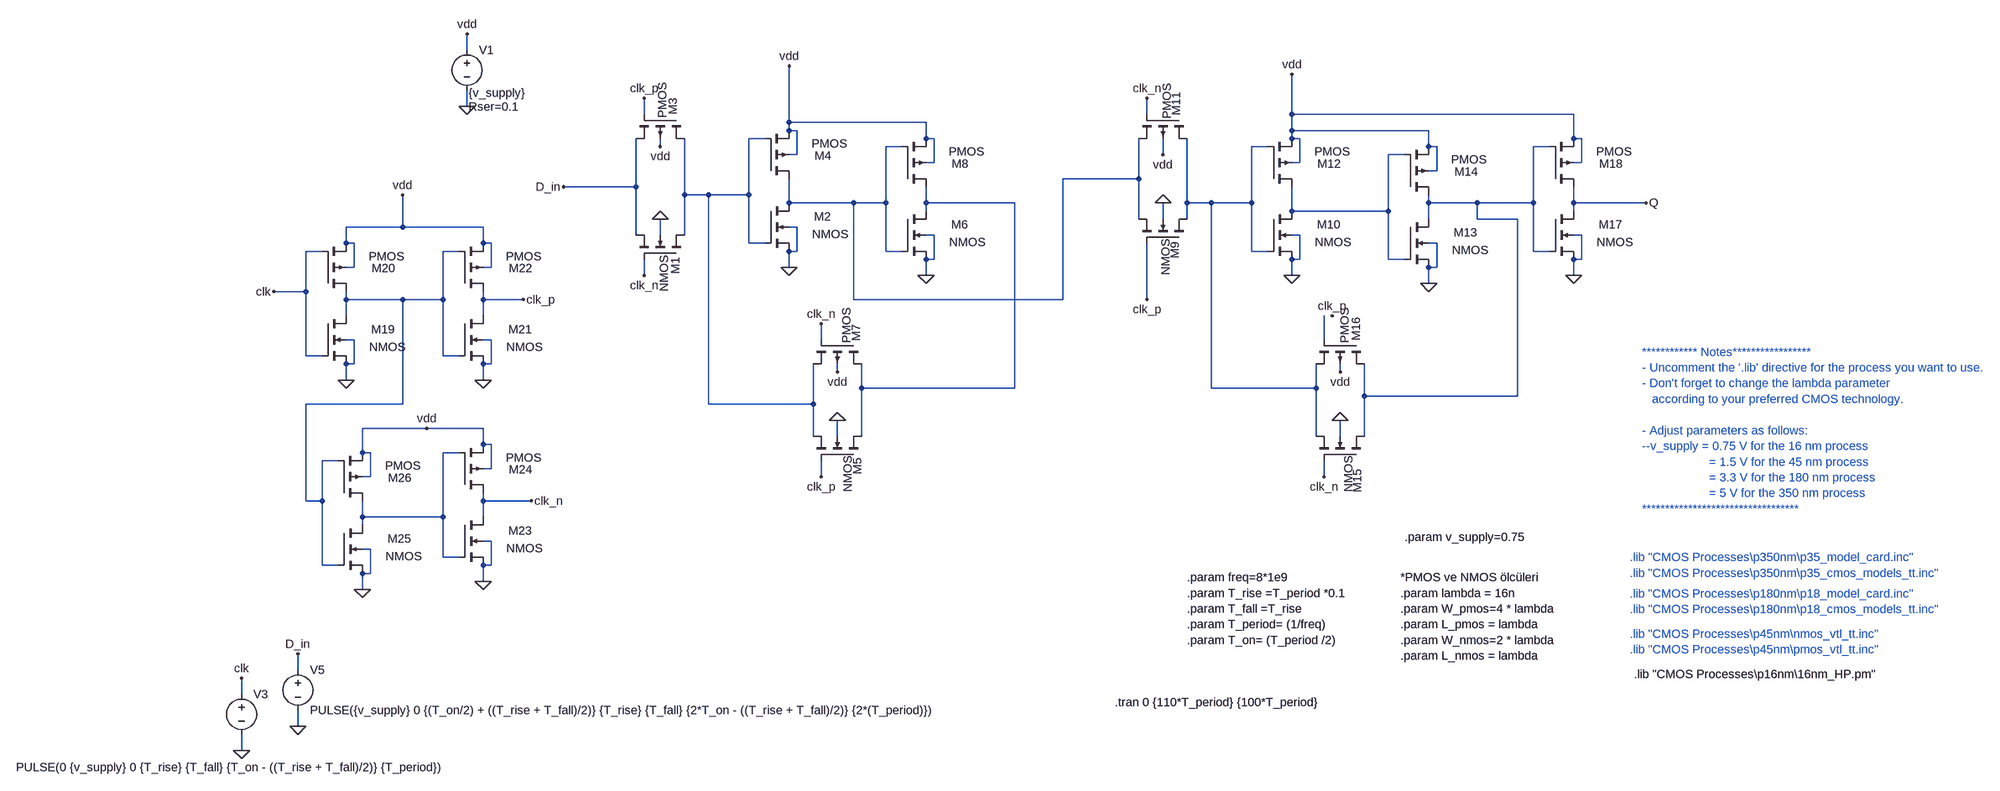
[diagram p0: schematic D_FF_sim.asc]
D_FF_sim.asc, the LTspice schematic file:
Version 4
SHEET 1 3284 1428
WIRE 96 -176 96 -208
WIRE 96 -64 96 -96
WIRE 448 -48 448 -80
WIRE 1552 -48 1552 -80
WIRE 1840 -48 1840 -128
WIRE 2400 -48 1840 -48
WIRE 736 -32 736 -144
WIRE 1008 -32 736 -32
WIRE 736 -16 736 -32
WIRE 752 -16 736 -16
WIRE 1840 -16 1840 -48
WIRE 2112 -16 1840 -16
WIRE 688 0 656 0
WIRE 1008 0 1008 -32
WIRE 1024 0 1008 0
WIRE 1840 0 1840 -16
WIRE 1856 0 1840 0
WIRE 2400 0 2400 -48
WIRE 2416 0 2400 0
WIRE 480 16 480 0
WIRE 960 16 928 16
WIRE 1792 16 1760 16
WIRE 2112 16 2112 -16
WIRE 2128 16 2112 16
WIRE 2352 16 2320 16
WIRE 752 32 752 -16
WIRE 752 32 736 32
WIRE 1584 32 1584 0
WIRE 2064 32 2032 32
WIRE 1024 48 1024 0
WIRE 1024 48 1008 48
WIRE 1856 48 1856 0
WIRE 1856 48 1840 48
WIRE 2416 48 2416 0
WIRE 2416 48 2400 48
WIRE 2128 64 2128 16
WIRE 2128 64 2112 64
WIRE 1536 80 1536 0
WIRE 1536 80 1280 80
WIRE 432 96 432 0
WIRE 432 96 288 96
WIRE 528 112 528 0
WIRE 576 112 528 112
WIRE 656 112 656 0
WIRE 656 112 576 112
WIRE 736 128 736 80
WIRE 864 128 736 128
WIRE 928 128 928 16
WIRE 928 128 864 128
WIRE 1008 128 1008 96
WIRE 1184 128 1008 128
WIRE 1632 128 1632 0
WIRE 1680 128 1632 128
WIRE 1760 128 1760 16
WIRE 1760 128 1680 128
WIRE 2112 128 2112 112
WIRE 2208 128 2112 128
WIRE 2320 128 2320 16
WIRE 2320 128 2208 128
WIRE 2400 128 2400 96
WIRE 2544 128 2400 128
WIRE 1008 144 1008 128
WIRE 1840 144 1840 96
WIRE 2032 144 2032 32
WIRE 2032 144 1840 144
WIRE 2400 144 2400 128
WIRE 1536 160 1536 80
WIRE 1584 160 1584 128
WIRE 1632 160 1632 128
WIRE 2112 160 2112 128
WIRE 2208 160 2208 128
WIRE 2288 160 2208 160
WIRE -32 176 -32 112
WIRE -32 176 -144 176
WIRE 128 176 -32 176
WIRE 752 176 736 176
WIRE 432 192 432 96
WIRE 480 192 480 160
WIRE 528 192 528 112
WIRE 1024 192 1008 192
WIRE 1856 192 1840 192
WIRE 2416 192 2400 192
WIRE -144 208 -144 176
WIRE -128 208 -144 208
WIRE 128 208 128 176
WIRE 144 208 128 208
WIRE 656 208 656 112
WIRE 688 208 656 208
WIRE 2128 208 2112 208
WIRE -192 224 -224 224
WIRE 80 224 48 224
WIRE 752 224 752 176
WIRE 752 224 736 224
WIRE 928 224 928 128
WIRE 960 224 928 224
WIRE 1760 224 1760 128
WIRE 1792 224 1760 224
WIRE 2320 224 2320 128
WIRE 2352 224 2320 224
WIRE 1024 240 1024 192
WIRE 1024 240 1008 240
WIRE 1856 240 1856 192
WIRE 1856 240 1840 240
WIRE 2032 240 2032 144
WIRE 2064 240 2032 240
WIRE 2416 240 2416 192
WIRE 2416 240 2400 240
WIRE -128 256 -128 208
WIRE -128 256 -144 256
WIRE 144 256 144 208
WIRE 144 256 128 256
WIRE 736 256 736 224
WIRE 2128 256 2128 208
WIRE 2128 256 2112 256
WIRE 448 272 448 240
WIRE 1008 272 1008 240
WIRE 1840 272 1840 240
WIRE 2400 272 2400 240
WIRE 2112 288 2112 256
WIRE -224 304 -224 224
WIRE -224 304 -288 304
WIRE -144 320 -144 304
WIRE -32 320 -144 320
WIRE 48 320 48 224
WIRE 48 320 -32 320
WIRE 128 320 128 304
WIRE 208 320 128 320
WIRE 864 320 864 128
WIRE 1280 320 1280 80
WIRE 1280 320 864 320
WIRE 1552 320 1552 208
WIRE -144 352 -144 320
WIRE 128 352 128 320
WIRE -128 400 -144 400
WIRE 144 400 128 400
WIRE 800 400 800 368
WIRE 1904 400 1904 352
WIRE -224 432 -224 304
WIRE -192 432 -224 432
WIRE 48 432 48 320
WIRE 80 432 48 432
WIRE -128 448 -128 400
WIRE -128 448 -144 448
WIRE 144 448 144 400
WIRE 144 448 128 448
WIRE 832 464 832 448
WIRE 1936 464 1936 448
WIRE -144 480 -144 448
WIRE 128 480 128 448
WIRE 880 496 880 448
WIRE 1184 496 1184 128
WIRE 1184 496 880 496
WIRE 1680 496 1680 128
WIRE 1888 496 1888 448
WIRE 1888 496 1680 496
WIRE 1984 512 1984 448
WIRE 2288 512 2288 160
WIRE 2288 512 1984 512
WIRE -32 528 -32 320
WIRE -32 528 -224 528
WIRE 576 528 576 112
WIRE 784 528 784 448
WIRE 784 528 576 528
WIRE 16 576 -112 576
WIRE 128 576 16 576
WIRE 784 592 784 528
WIRE 832 592 832 560
WIRE 880 592 880 496
WIRE 1888 592 1888 496
WIRE 1936 592 1936 560
WIRE 1984 592 1984 512
WIRE 128 608 128 576
WIRE 144 608 128 608
WIRE -112 624 -112 576
WIRE -96 624 -112 624
WIRE 80 624 48 624
WIRE -160 640 -192 640
WIRE 144 656 144 608
WIRE 144 656 128 656
WIRE -96 672 -96 624
WIRE -96 672 -112 672
WIRE 800 672 800 640
WIRE 1904 672 1904 640
WIRE -224 720 -224 528
WIRE -192 720 -192 640
WIRE -192 720 -224 720
WIRE 128 720 128 704
WIRE 224 720 128 720
WIRE -112 752 -112 720
WIRE 48 752 48 624
WIRE 48 752 -112 752
WIRE 128 752 128 720
WIRE -112 768 -112 752
WIRE 144 800 128 800
WIRE -96 816 -112 816
WIRE 48 832 48 752
WIRE 80 832 48 832
WIRE -192 848 -192 720
WIRE -160 848 -192 848
WIRE 144 848 144 800
WIRE 144 848 128 848
WIRE -96 864 -96 816
WIRE -96 864 -112 864
WIRE 128 880 128 848
WIRE -112 896 -112 864
WIRE -240 1056 -240 1024
WIRE -352 1104 -352 1072
WIRE -240 1168 -240 1136
WIRE -352 1216 -352 1184
FLAG 288 96 D_in
FLAG 96 -64 0
FLAG -352 1216 0
FLAG 96 -208 vdd
FLAG 208 320 clk_p
FLAG 224 720 clk_n
FLAG 448 -80 clk_p
FLAG 448 272 clk_n
FLAG -240 1168 0
FLAG -240 1024 D_in
FLAG 736 256 0
FLAG 1008 272 0
FLAG 480 16 vdd
FLAG 480 160 0
FLAG 800 672 clk_p
FLAG 800 368 clk_n
FLAG 832 464 vdd
FLAG 832 560 0
FLAG 1552 320 clk_p
FLAG 1840 272 0
FLAG 2112 288 0
FLAG 1584 32 vdd
FLAG 1584 128 0
FLAG 1920 352 clk_p
FLAG 1904 672 clk_n
FLAG 1936 464 vdd
FLAG 1936 560 0
FLAG 736 -144 vdd
FLAG 1840 -128 vdd
FLAG 2544 128 Q
FLAG 1552 -80 clk_n
FLAG 2400 272 0
FLAG -32 112 vdd
FLAG -352 1072 clk
FLAG -144 480 0
FLAG 128 480 0
FLAG -288 304 clk
FLAG 128 880 0
FLAG -112 896 0
FLAG 16 576 vdd
SYMBOL nmos4 528 240 M270
WINDOW 0 -30 17 Left 2
WINDOW 3 -65 40 Left 2
SYMATTR InstName M1
SYMATTR Value2 l=L_nmos w=W_nmos
SYMBOL nmos4 688 128 R0
WINDOW 0 98 27 Left 2
WINDOW 3 94 62 Left 2
SYMATTR InstName M2
SYMATTR Value2 l=L_nmos w=W_nmos
SYMBOL pmos4 528 -48 R90
WINDOW 0 -33 22 Left 2
WINDOW 3 -63 43 Left 2
SYMATTR InstName M3
SYMATTR Value2 l=L_pmos w=W_pmos
SYMBOL pmos4 688 80 M180
WINDOW 0 99 46 Left 2
WINDOW 3 93 70 Left 2
SYMATTR InstName M4
SYMATTR Value2 l=L_pmos w=W_pmos
SYMBOL voltage 96 -192 R0
WINDOW 3 3 101 Left 2
WINDOW 123 0 0 Left 0
WINDOW 39 3 129 Left 2
SYMATTR Value {v_supply}
SYMATTR SpiceLine Rser=0.1
SYMATTR InstName V1
SYMBOL voltage -352 1088 R0
WINDOW 3 -448 161 Left 2
WINDOW 123 0 0 Left 0
WINDOW 39 0 0 Left 0
SYMATTR Value PULSE(0 {v_supply} 0 {T_rise} {T_fall} {T_on - ((T_rise + T_fall)/2)} {T_period})
SYMATTR InstName V3
SYMBOL voltage -240 1040 R0
WINDOW 123 0 0 Left 0
WINDOW 39 0 0 Left 0
SYMATTR InstName V5
SYMATTR Value PULSE({v_supply} 0 {(T_on/2) + ((T_rise + T_fall)/2)} {T_rise} {T_fall} {2*T_on - ((T_rise + T_fall)/2)} {2*(T_period)})
SYMBOL nmos4 960 144 R0
WINDOW 0 98 27 Left 2
WINDOW 3 94 62 Left 2
SYMATTR InstName M6
SYMATTR Value2 l=L_nmos w=W_nmos
SYMBOL pmos4 960 96 M180
WINDOW 0 99 46 Left 2
WINDOW 3 93 70 Left 2
SYMATTR InstName M8
SYMATTR Value2 l=L_pmos w=W_pmos
SYMBOL nmos4 880 640 M270
WINDOW 0 -28 8 Left 2
WINDOW 3 -63 27 Left 2
SYMATTR InstName M5
SYMATTR Value2 l=L_nmos w=W_nmos
SYMBOL pmos4 880 400 R90
WINDOW 0 -31 10 Left 2
WINDOW 3 -63 29 Left 2
SYMATTR InstName M7
SYMATTR Value2 l=L_pmos w=W_pmos
SYMBOL nmos4 1632 208 M270
WINDOW 0 -31 24 Left 2
WINDOW 3 -64 42 Left 2
SYMATTR InstName M9
SYMATTR Value2 l=L_nmos w=W_nmos
SYMBOL nmos4 1792 144 R0
WINDOW 0 98 27 Left 2
WINDOW 3 94 62 Left 2
SYMATTR InstName M10
SYMATTR Value2 l=L_nmos w=W_nmos
SYMBOL pmos4 1632 -48 R90
WINDOW 0 -44 21 Left 2
WINDOW 3 -61 40 Left 2
SYMATTR InstName M11
SYMATTR Value2 l=L_pmos w=W_pmos
SYMBOL pmos4 1792 96 M180
WINDOW 0 99 46 Left 2
WINDOW 3 93 70 Left 2
SYMATTR InstName M12
SYMATTR Value2 l=L_pmos w=W_pmos
SYMBOL nmos4 2064 160 R0
WINDOW 0 98 27 Left 2
WINDOW 3 94 62 Left 2
SYMATTR InstName M13
SYMATTR Value2 l=L_nmos w=W_nmos
SYMBOL pmos4 2064 112 M180
WINDOW 0 99 46 Left 2
WINDOW 3 93 70 Left 2
SYMATTR InstName M14
SYMATTR Value2 l=L_pmos w=W_pmos
SYMBOL nmos4 1984 640 M270
WINDOW 0 -64 13 Left 2
WINDOW 3 -63 31 Left 2
SYMATTR InstName M15
SYMATTR Value2 l=L_nmos w=W_nmos
SYMBOL pmos4 1984 400 R90
WINDOW 0 -45 16 Left 2
WINDOW 3 -63 38 Left 2
SYMATTR InstName M16
SYMATTR Value2 l=L_pmos w=W_pmos
SYMBOL nmos4 2352 144 R0
WINDOW 0 98 27 Left 2
WINDOW 3 94 62 Left 2
SYMATTR InstName M17
SYMATTR Value2 l=L_nmos w=W_nmos
SYMBOL pmos4 2352 96 M180
WINDOW 0 99 46 Left 2
WINDOW 3 93 70 Left 2
SYMATTR InstName M18
SYMATTR Value2 l=L_pmos w=W_pmos
SYMBOL nmos4 -192 352 R0
WINDOW 0 98 27 Left 2
WINDOW 3 94 62 Left 2
SYMATTR InstName M19
SYMATTR Value2 l=L_nmos w=W_nmos
SYMBOL pmos4 -192 304 M180
WINDOW 0 99 46 Left 2
WINDOW 3 93 70 Left 2
SYMATTR InstName M20
SYMATTR Value2 l=L_pmos w=W_pmos
SYMBOL nmos4 80 352 R0
WINDOW 0 98 27 Left 2
WINDOW 3 94 62 Left 2
SYMATTR InstName M21
SYMATTR Value2 l=L_nmos w=W_nmos
SYMBOL pmos4 80 304 M180
WINDOW 0 99 46 Left 2
WINDOW 3 93 70 Left 2
SYMATTR InstName M22
SYMATTR Value2 l=L_pmos w=W_pmos
SYMBOL nmos4 80 752 R0
WINDOW 0 98 27 Left 2
WINDOW 3 94 62 Left 2
SYMATTR InstName M23
SYMATTR Value2 l=L_nmos w=W_nmos
SYMBOL pmos4 80 704 M180
WINDOW 0 99 46 Left 2
WINDOW 3 93 70 Left 2
SYMATTR InstName M24
SYMATTR Value2 l=L_pmos w=W_pmos
SYMBOL nmos4 -160 768 R0
WINDOW 0 98 27 Left 2
WINDOW 3 94 62 Left 2
SYMATTR InstName M25
SYMATTR Value2 l=L_nmos w=W_nmos
SYMBOL pmos4 -160 720 M180
WINDOW 0 99 46 Left 2
WINDOW 3 93 70 Left 2
SYMATTR InstName M26
SYMATTR Value2 l=L_pmos w=W_pmos
TEXT 2064 792 Left 2 !.param v_supply=0.75
TEXT 1632 872 Left 2 !.param freq=8*1e9\n.param T_rise =T_period *0.1\n.param T_fall =T_rise \n.param T_period= (1/freq)\n.param T_on= (T_period /2)
TEXT 2056 872 Left 2 !*PMOS ve NMOS ölcüleri\n.param lambda = 16n\n.param W_pmos=4 * lambda \n.param L_pmos = lambda \n.param W_nmos=2 * lambda \n.param L_nmos = lambda
TEXT 1488 1120 Left 2 !.tran 0 {110*T_period} {100*T_period}
TEXT 2512 832 Left 2 ;.lib "CMOS Processes\\p350nm\\p35_model_card.inc"\n.lib "CMOS Processes\\p350nm\\p35_cmos_models_tt.inc"
TEXT 2512 904 Left 2 ;.lib "CMOS Processes\\p180nm\\p18_model_card.inc"\n.lib "CMOS Processes\\p180nm\\p18_cmos_models_tt.inc"
TEXT 2512 984 Left 2 ;.lib "CMOS Processes\\p45nm\\nmos_vtl_tt.inc"\n.lib "CMOS Processes\\p45nm\\pmos_vtl_tt.inc"
TEXT 2520 1064 Left 2 !.lib "CMOS Processes\\p16nm\\16nm_HP.pm"
TEXT 2536 424 Left 2 ;************ Notes*****************\n- Uncomment the '.lib' directive for the process you want to use.\n- Don't forget to change the lambda parameter \n   according to your preferred CMOS technology.\n \n- Adjust parameters as follows:\n--v_supply = 0.75 V for the 16 nm process\n                    = 1.5 V for the 45 nm process\n                    = 3.3 V for the 180 nm process\n                    = 5 V for the 350 nm process\n**********************************

The netlist it stands for:
* D_FF_sim.asc
M1 N001 clk_n D_in 0 NMOS l=L_nmos w=W_nmos
M2 N002 N001 0 0 NMOS l=L_nmos w=W_nmos
M3 N001 clk_p D_in vdd PMOS l=L_pmos w=W_pmos
M4 N002 N001 vdd vdd PMOS l=L_pmos w=W_pmos
V1 vdd 0 {v_supply} Rser=0.1
V3 clk 0 PULSE(0 {v_supply} 0 {T_rise} {T_fall} {T_on - ((T_rise + T_fall)/2)} {T_period})
V5 D_in 0 PULSE({v_supply} 0 {(T_on/2) + ((T_rise + T_fall)/2)} {T_rise} {T_fall} {2*T_on - ((T_rise + T_fall)/2)} {2*(T_period)})
M6 N006 N002 0 0 NMOS l=L_nmos w=W_nmos
M8 N006 N002 vdd vdd PMOS l=L_pmos w=W_pmos
M5 N006 clk_p N001 0 NMOS l=L_nmos w=W_nmos
M7 N006 clk_n N001 vdd PMOS l=L_pmos w=W_pmos
M9 N003 clk_p N002 0 NMOS l=L_nmos w=W_nmos
M10 N005 N003 0 0 NMOS l=L_nmos w=W_nmos
M11 N003 clk_n N002 vdd PMOS l=L_pmos w=W_pmos
M12 N005 N003 vdd vdd PMOS l=L_pmos w=W_pmos
M13 N004 N005 0 0 NMOS l=L_nmos w=W_nmos
M14 N004 N005 vdd vdd PMOS l=L_pmos w=W_pmos
M15 N004 clk_n N003 0 NMOS l=L_nmos w=W_nmos
M16 N004 N008 N003 vdd PMOS l=L_pmos w=W_pmos
M17 Q N004 0 0 NMOS l=L_nmos w=W_nmos
M18 Q N004 vdd vdd PMOS l=L_pmos w=W_pmos
M19 N007 clk 0 0 NMOS l=L_nmos w=W_nmos
M20 N007 clk vdd vdd PMOS l=L_pmos w=W_pmos
M21 clk_p N007 0 0 NMOS l=L_nmos w=W_nmos
M22 clk_p N007 vdd vdd PMOS l=L_pmos w=W_pmos
M23 clk_n N009 0 0 NMOS l=L_nmos w=W_nmos
M24 clk_n N009 vdd vdd PMOS l=L_pmos w=W_pmos
M25 N009 N007 0 0 NMOS l=L_nmos w=W_nmos
M26 N009 N007 vdd vdd PMOS l=L_pmos w=W_pmos
.model NMOS NMOS
.model PMOS PMOS
.lib standard.mos
.param v_supply=0.75
.param freq=8*1e9
.param T_rise =T_period *0.1
.param T_fall =T_rise
.param T_period= (1/freq)
.param T_on= (T_period /2)
*PMOS ve NMOS ölcüleri
.param lambda = 16n
.param W_pmos=4 * lambda
.param L_pmos = lambda
.param W_nmos=2 * lambda
.param L_nmos = lambda
.tran 0 {110*T_period} {100*T_period}
* .lib "CMOS Processes\p350nm\p35_model_card.inc"
* .lib "CMOS Processes\p350nm\p35_cmos_models_tt.inc"
* .lib "CMOS Processes\p180nm\p18_model_card.inc"
* .lib "CMOS Processes\p180nm\p18_cmos_models_tt.inc"
* .lib "CMOS Processes\p45nm\nmos_vtl_tt.inc"
* .lib "CMOS Processes\p45nm\pmos_vtl_tt.inc"
.lib "CMOS Processes\p16nm\16nm_HP.pm"
* ************ Notes*****************
* - Uncomment the '.lib' directive for the process you want to use.
* - Don't forget to change the lambda parameter
*    according to your preferred CMOS technology.
* - Adjust parameters as follows:
* --v_supply = 0.75 V for the 16 nm process
*                     = 1.5 V for the 45 nm process
*                     = 3.3 V for the 180 nm process
*                     = 5 V for the 350 nm process
* **********************************
.backanno
.end